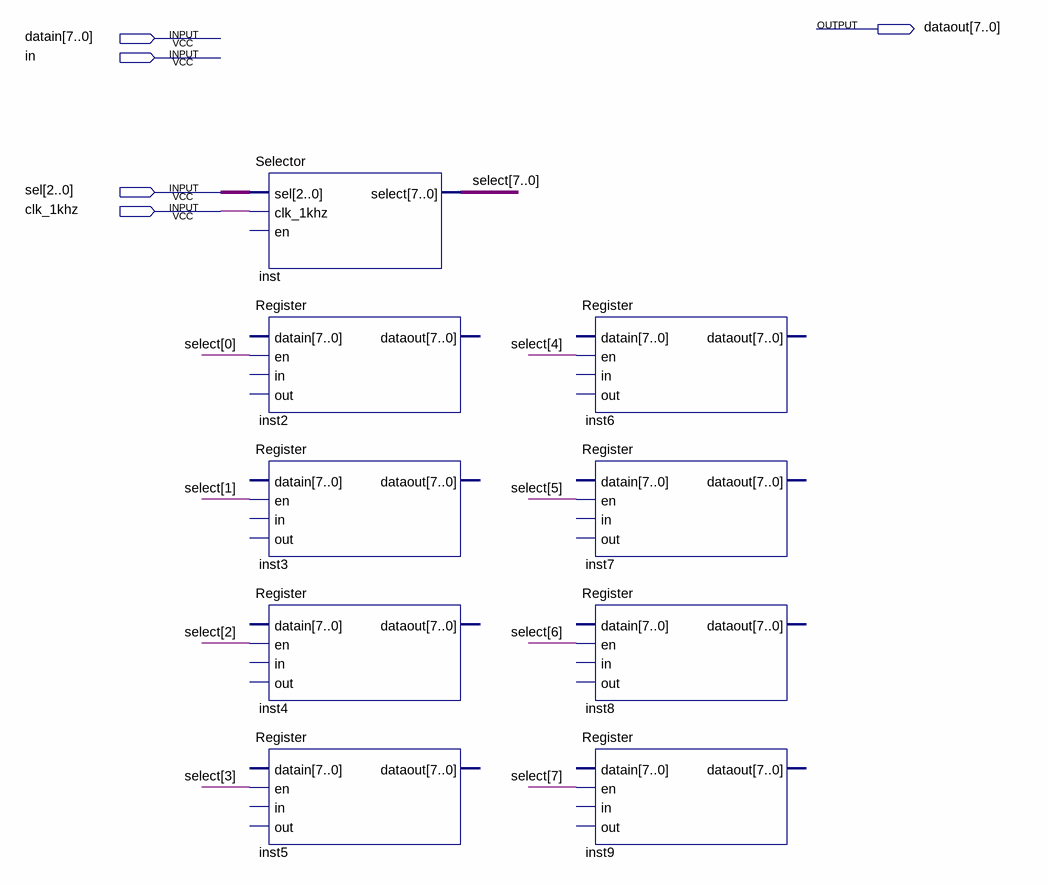
[diagram p0: schematic sheet]
// Quartus schematic RegisterFile.bdf as structural Verilog: 9 symbols, 5 pins
module RegisterFile (
  input  [7:0] datain,
  input  in,
  input  [2:0] sel,
  input  clk_1khz,
  output [7:0] dataout
);

  wire [7:0] select;

  Selector inst (.sel(sel), .clk_1khz(clk_1khz), .select(select));  // open: en
  Register inst2 (.en(select[0]));  // open: datain, in, out, dataout
  Register inst3 (.en(select[1]));  // open: datain, in, out, dataout
  Register inst4 (.en(select[2]));  // open: datain, in, out, dataout
  Register inst5 (.en(select[3]));  // open: datain, in, out, dataout
  Register inst6 (.en(select[4]));  // open: datain, in, out, dataout
  Register inst7 (.en(select[5]));  // open: datain, in, out, dataout
  Register inst8 (.en(select[6]));  // open: datain, in, out, dataout
  Register inst9 (.en(select[7]));  // open: datain, in, out, dataout
endmodule
